# EAGLE schematic OpenOTA (EAGLE 7.6.0)
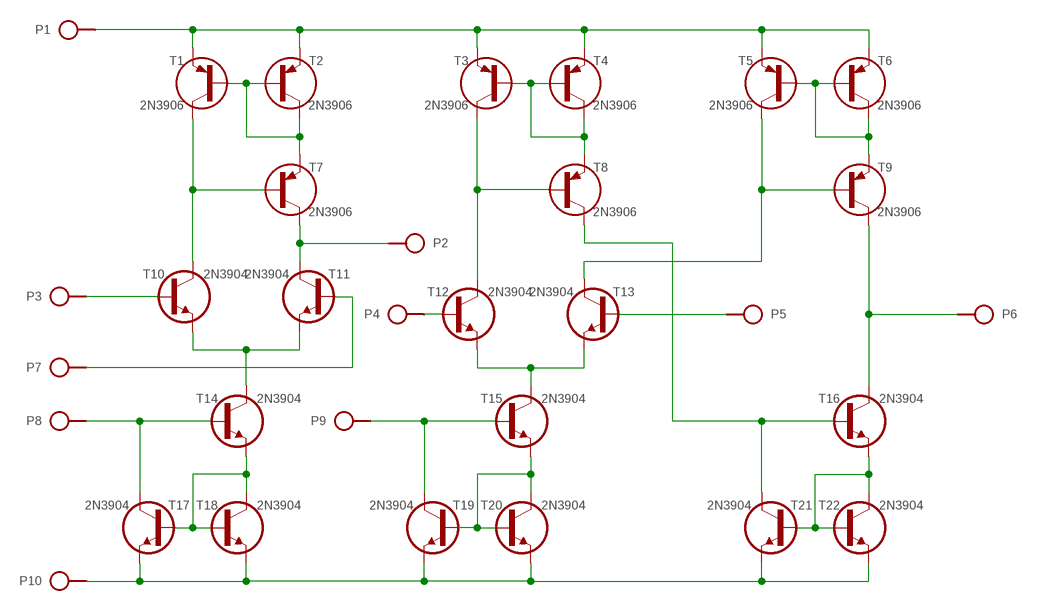
[diagram p0: schematic, sheet 1]

## Parts
P1  SPAD  [SPAD]
P2  SPAD  [SPAD]
P3  SPAD  [SPAD]
P4  SPAD  [SPAD]
P5  SPAD  [SPAD]
P6  SPAD  [SPAD]
P7  SPAD  [SPAD]
P8  SPAD  [SPAD]
P9  SPAD  [SPAD]
P10  SPAD  [SPAD]
T1  2N3906  [TO92]
T2  2N3906  [TO92]
T3  2N3906  [TO92]
T4  2N3906  [TO92]
T5  2N3906  [TO92]
T6  2N3906  [TO92]
T7  2N3906  [TO92]
T8  2N3906  [TO92]
T9  2N3906  [TO92]
T10  2N3904  [TO92]
T11  2N3904  [TO92]
T12  2N3904  [TO92]
T13  2N3904  [TO92]
T14  2N3904  [TO92]
T15  2N3904  [TO92]
T16  2N3904  [TO92]
T17  2N3904  [TO92]
T18  2N3904  [TO92]
T19  2N3904  [TO92]
T20  2N3904  [TO92]
T21  2N3904  [TO92]
T22  2N3904  [TO92]

## Nets
+15: P1.1 T1.1(E) T2.1(E) T3.1(E) T4.1(E) T5.1(E) T6.1(E)
-15: P10.1 T17.1(E) T18.1(E) T19.1(E) T20.1(E) T21.1(E) T22.1(E)
I_A: P8.1 T14.2(B) T17.3(C)
I_B: P9.1 T15.2(B) T19.3(C)
IN_A+: P3.1 T10.2(B)
IN_A-: P7.1 T11.2(B)
IN_B+: P5.1 T13.2(B)
IN_B-: P4.1 T12.2(B)
IO_A: P2.1 T7.3(C) T11.3(C)
N$2: T1.2(B) T2.2(B) T2.3(C) T7.1(E)
N$3: T1.3(C) T7.2(B) T10.3(C)
N$5: T12.1(E) T13.1(E) T15.3(C)
N$6: T3.2(B) T4.2(B) T4.3(C) T8.1(E)
N$7: T3.3(C) T8.2(B) T12.3(C)
N$8: T10.1(E) T11.1(E) T14.3(C)
N$9: T8.3(C) T16.2(B) T21.3(C)
N$10: T5.2(B) T6.2(B) T6.3(C) T9.1(E)
N$11: T5.3(C) T9.2(B) T13.3(C)
N$15: T14.1(E) T17.2(B) T18.2(B) T18.3(C)
N$18: T15.1(E) T19.2(B) T20.2(B) T20.3(C)
N$21: T16.1(E) T21.2(B) T22.2(B) T22.3(C)
OB: P6.1 T9.3(C) T16.3(C)

## Library data of the parts
P1-P10 = pad:SPAD
T1-T9 = t:2N3906
T10-T22 = t:2N3904